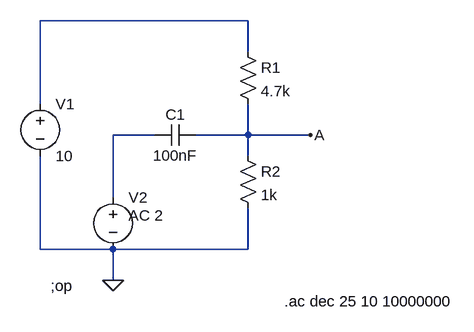
[diagram p0: schematic Draft2.asc]
Draft2.asc, the LTspice schematic file:
Version 4
SHEET 1 880 680
WIRE 416 -16 96 -16
WIRE 416 32 416 -16
WIRE 96 112 96 -16
WIRE 272 160 208 160
WIRE 416 160 416 112
WIRE 416 160 336 160
WIRE 512 160 416 160
WIRE 416 192 416 160
WIRE 208 256 208 160
WIRE 96 336 96 192
WIRE 208 336 96 336
WIRE 416 336 416 272
WIRE 416 336 208 336
WIRE 208 384 208 336
FLAG 512 160 A
FLAG 208 384 0
SYMBOL voltage 96 96 R0
WINDOW 123 0 0 Left 0
WINDOW 39 0 0 Left 0
SYMATTR InstName V1
SYMATTR Value 10
SYMBOL res 400 16 R0
SYMATTR InstName R1
SYMATTR Value 4.7k
SYMBOL res 400 176 R0
SYMATTR InstName R2
SYMATTR Value 1k
SYMBOL cap 336 144 R90
WINDOW 0 0 32 VBottom 2
WINDOW 3 32 32 VTop 2
SYMATTR InstName C1
SYMATTR Value 100nF
SYMBOL voltage 208 240 R0
WINDOW 123 24 44 Left 2
WINDOW 39 0 0 Left 0
SYMATTR Value2 AC 2
SYMATTR InstName V2
SYMATTR Value ""
TEXT 112 392 Left 2 !;op
TEXT 472 416 Left 2 !.ac dec 25 10 10000000

The netlist it stands for:
* Draft2.asc
V1 N001 0 10
R1 N001 A 4.7k
R2 A 0 1k
C1 A N002 100nF
V2 N002 0 AC 2
;op
.ac dec 25 10 10000000
.backanno
.end

* Results of the author's LTspice run, read from the files saved beside the schematic
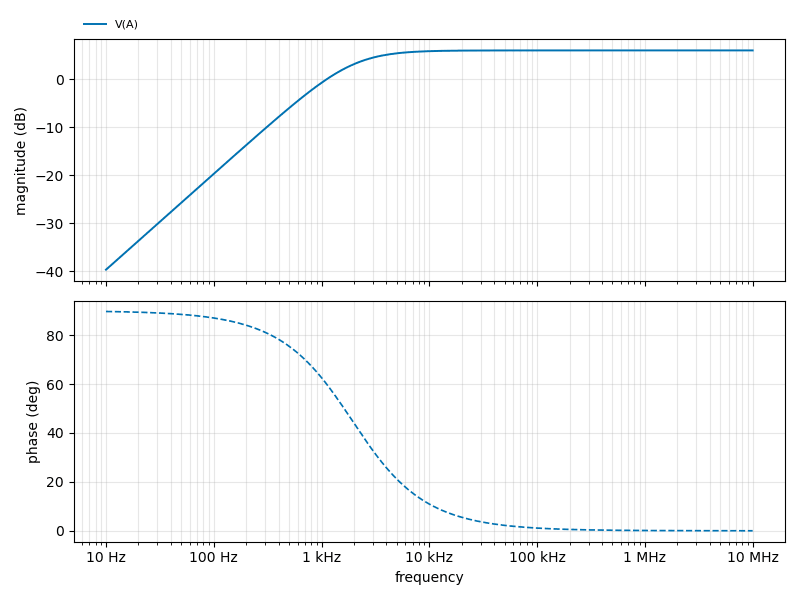
[diagram p1: AC Analysis of Draft2.asc, plotted from the saved traces]
* AC Analysis, 1 run:
*   V(A): -39.69 dB at 10 Hz, 6.02 dB at 10 MHz, peak 6.02 dB at 10 MHz, 3 dB below the peak at 1.931 kHz